# Altium schematic sheet Headers_Power.SchDoc
size A4; SheetNumber: 3; SheetTotal: 4
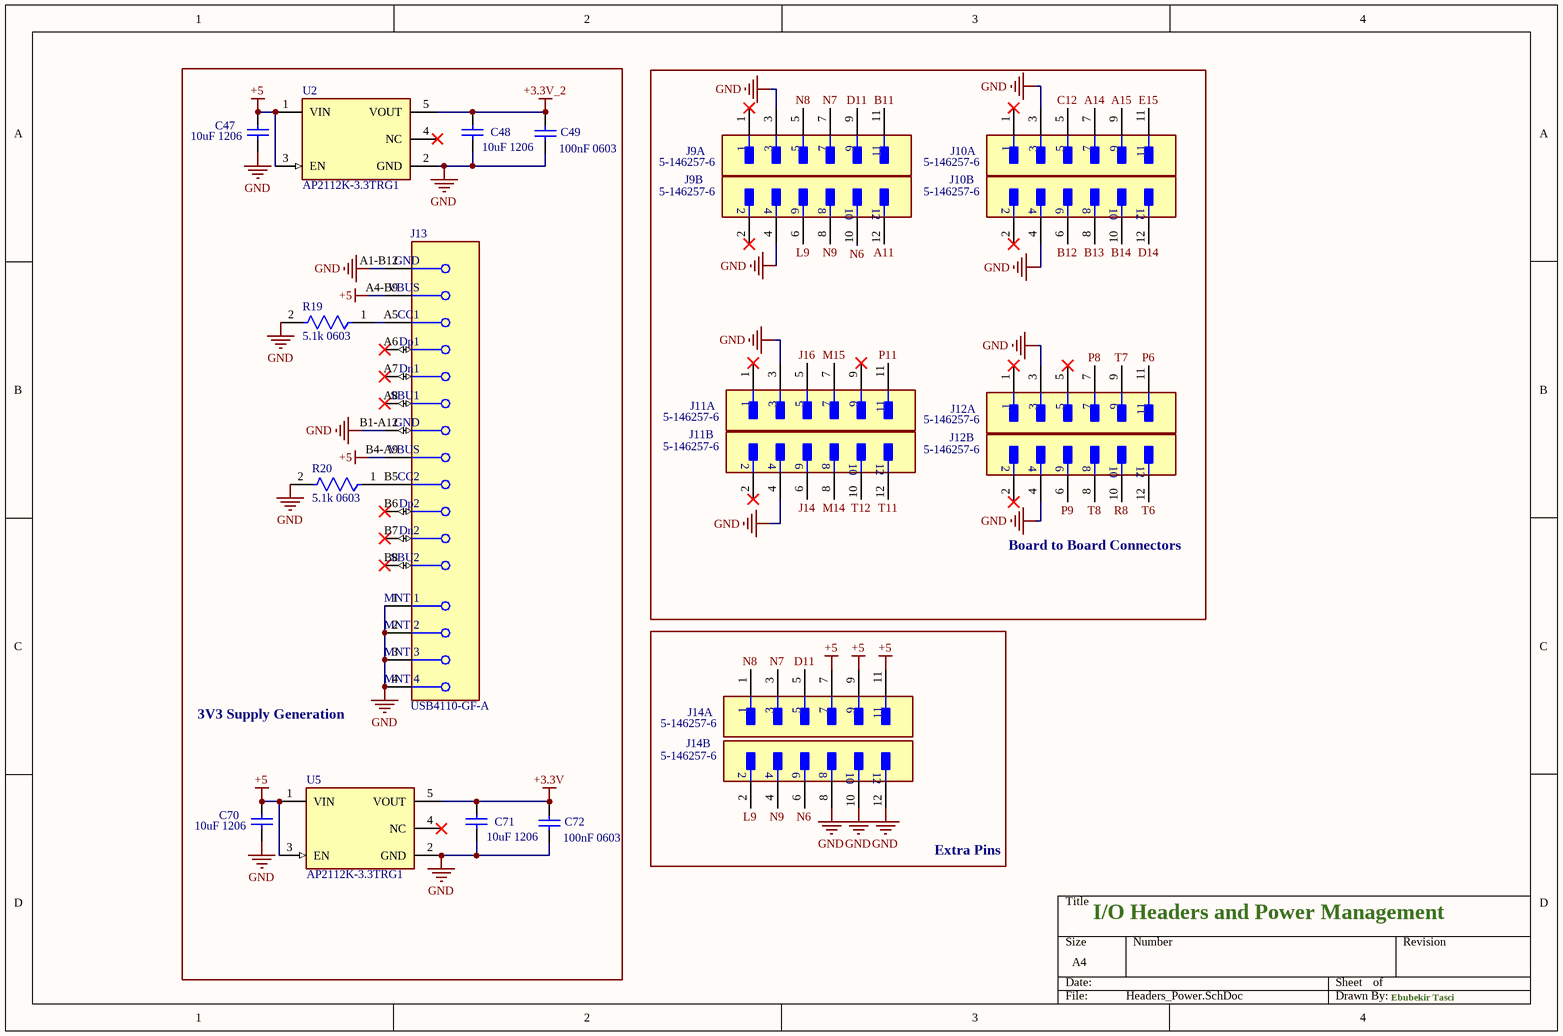
[diagram p0: Headers_Power.SchDoc]

## Parts
C47  10uF 1206  [CAPC1206(3216)190_M]
C48  10uF 1206  [CAPC1206(3216)190_M]
C49  100nF 0603  [CAPC0603(1608)100_L]
C70  10uF 1206  [CAPC1206(3216)190_M]
C71  10uF 1206  [CAPC1206(3216)190_M]
C72  100nF 0603  [CAPC0603(1608)100_L]
J9  5-146257-6  [FP-5-146257-6-MFG]  (parts A,B of 2)
J10  5-146257-6  [FP-5-146257-6-MFG]  (parts A,B of 2)
J11  5-146257-6  [FP-5-146257-6-MFG]  (parts A,B of 2)
J12  5-146257-6  [FP-5-146257-6-MFG]  (parts A,B of 2)
J13  USB4110-GF-A  [FP-USB4110-GF-A-MFG]
J14  5-146257-6  [FP-5-146257-6-MFG]  (parts A,B of 2)
R19  5.1k 0603  [FP-MCT0603-IPC_A]
R20  5.1k 0603  [FP-MCT0603-IPC_A]
U2  AP2112K-3.3TRG1  [FP-SOT25-IPC_A]
U5  AP2112K-3.3TRG1  [FP-SOT25-IPC_A]

## Blocks framed on the sheet
3V3 Supply Generation: C47-C49 C70-C72 J13 R19 R20 U2 U5
Board to Board Connectors: J9-J12
Extra Pins: J14

## Nets
+3.3V: C71.2 C72.1 U5.5(VOUT)
+3.3V_2: C48.2 C49.1 U2.5(VOUT)
+5: C47.2 C70.2 J13.A4-B9(VBUS) J13.B4-A9(VBUS) J14.7 J14.9 J14.11 U2.1(VIN) U2.3(EN) U5.1(VIN) U5.3(EN)
GND: C47.1 C48.1 C49.2 C70.1 C71.1 C72.2 J9.3 J9.4 J10.3 J10.4 J11.3 J11.4 J12.3 J12.4 J13.1(MNT_1) J13.2(MNT_2) J13.3(MNT_3) J13.4(MNT_4) J13.A1-B12(GND) J13.B1-A12(GND) J14.8 J14.10 J14.12 R19.2 R20.2 U2.2(GND) U5.2(GND)
A11: J9.12
A14: J10.7
A15: J10.9
B11: J9.11
B12: J10.6
B13: J10.8
B14: J10.10
C12: J10.5
D11: J9.9 J14.5
D14: J10.12
E15: J10.11
J14: J11.6
J16: J11.5
L9: J9.6 J14.2
M14: J11.8
M15: J11.7
N6: J9.10 J14.6
N7: J9.7 J14.3
N8: J9.5 J14.1
N9: J9.8 J14.4
P6: J12.11
P8: J12.7
P9: J12.6
P11: J11.11
R8: J12.10
T6: J12.12
T7: J12.9
T8: J12.8
T11: J11.12
T12: J11.10
NetJ13_A5: J13.A5(CC1) R19.1
NetJ13_B5: J13.B5(CC2) R20.1

Not connected (* = marked no-connect by the designer): J9 1* 2*; J10 1* 2*; J11 1* 2* 9*; J12 1* 2* 5*; J13 A6(Dp1)* A7(Dn1)* A8(SBU1)* B6(Dp2)* B7(Dn2)* B8(SBU2)*; U2 4(NC)*; U5 4(NC)*

## Notes on the sheet
- I/O Headers and Power Management
- Ebubekir Tasci

## Library data of the parts
C47 C48 C70 C71 = CMP-1037-04973-1: CAP 10uF 16V ±5% 1206 (3216 Metric) Thickness 1.9mm SMD; Case-EIA: 1206; Case-Metric: 3216; Tolerance: Â±5%; Rated Voltage: 16 V; Value: 10uF; Max Thickness: 1.9 mm; Technology: SMT
C49 C72 = CMP-1035-00228-1: CAP 100nF 16V ±0.1pF 0603 (1608 Metric) Thickness 1mm SMD; Case-EIA: 0603; Tolerance: Â±0.1pF; Case-Metric: 1608; Max Thickness: 1 mm; Technology: SMT; Value: 100nF; Rated Voltage: 16 V
J9-J12 J14 = CMP-03369-000148-1: CONN HEADER VERT 12POS 2.54MM; Gasket: No (Without); Voltage Rating: 750V; Insulation Resistance: 5GR; Keyed: No; PCB Mount Retention: Without; Approvals: CSA; High Temperature Housing: Yes; Board Standoff: Yes (With); Contact Current Rating: 3A; Number of Contacts: 12; PCB Thickness: 0.062inch; Contact Post Length: 0.12inch; PCB Mounting Orientation: Vertical; Connector Type: Plug; Housing Color: Black; Package Quantity: 240; Orientation: Straight; Mating Connector Lock: No (Without); Radiation Hardening: No; Stabilizers: No (Without); Pitch: 2.54mm; Contact Plating: Gold; Contact Gender: Male; Mount: Through Hole; Length: 14.83mm; Depth: 4.88mm; ELV: Compliant; Color: Black; Insulation Color: Black; Max Operating Temperature: 105°C; Contact Material: Bronze; Current Rating: 3A; Housing Material: Thermoplastic; Packaging: Carton; Mating Alignment: No (Without); Number of Rows: 2; Contact Finish - Mating: GOLD; Termination: Through Hole; Fastening Type: Pull; Contact Mating Length: 0.23inch; Number of Positions: 12; Contact Type: Male Pin; RoHS Compliant: Yes; Row Spacing: 2.54mm; Series: AMPMODU MOD II; Min Operating Temperature: -65°C; Contact Protection: No (Without); Flammability Rating: UL94 V-0; High Speed Serial Data Connector: No; Insulation Material: Polymer; Contact Shape: Square; Selectively Loaded: No (Without); Strain Relief: No (Without)
J13 = CMP-245163-000002-1: CONN USB 2.0 TYPE-C R/A SMT; Manufacturer: GCT; Conn Orientation: Right Angle; Usb Standard: USB 2.0; Voltage Rating: 20V; Current Rating: 3/4.25/1.25/0.25A; Number Of Contacts: 16; Is Female: yes; Shielding: true; Standoff Height: 0.1mm; Octopart: https://octopart.com/usb4110-gf-a-gct-103941985; Temperature: -40°C to +85°C; RoHS: TRUE; Automotive: No; Contact Material: Gold,Nickel; Device Class L1: Connectors; Device Class L2: USB Connectors; Package: 0; Lead Free: Yes; ComponentLink2URL: https://gct.co/files/drawings/usb4110.pdf; Temperature Range High: +85°C; Temperature Range Low: -40°C; Height: 3.46mm; Manufacturer Part Number: USB4110-GF-A; ComponentLink2Description: Datasheet; Device Class L3: unset; Digikey Description: CONN USB 2.0 TYPE-C R/A SMT; Category: Conn
R19 R20 = CMP-02407-005940-1: RES SMD 5.1 KOHM 1% 1/8W 0603; Composition: Thin Film; Depth: 0.85mm; Min Operating Temperature: -55°C; Military Standard: Not; Length: 1.55mm; Max Operating Temperature: 125°C; Tolerance: 1%; Resistance: 5.1k; Lead Free: Lead Free; Case/Package: 0603; Packaging: Tape and Reel
U2 U5 = CMP-12756-000035-1: IC REG LINEAR 3.3V 600MA SOT25; Number of Regulators: 1; Output Type: Fixed; Polarity: Positive; Min Input Voltage: 2.5V; Max Input Voltage: 6V; Accuracy: 1.5%; Quiescent Current: 55uA; Dropout Voltage: 250mV; Min Operating Temperature: -40°C; Length: 3.1mm; Output Current: 600mA; Max Operating Temperature: 85°C; Package Quantity: 1; Output Voltage: 3.3V; Width: 1.7mm; Number of Outputs: 1; Packaging: Tape and Reel; Height: 1.3mm; Lead Free: Lead Free; Max Output Current: 600mA; Case/Package: SOT-23-5; Mount: Surface Mount; Number of Pins: 5